# EasyEDA schematic LcsNodes-Diagnostic-Board-B.02.00.json
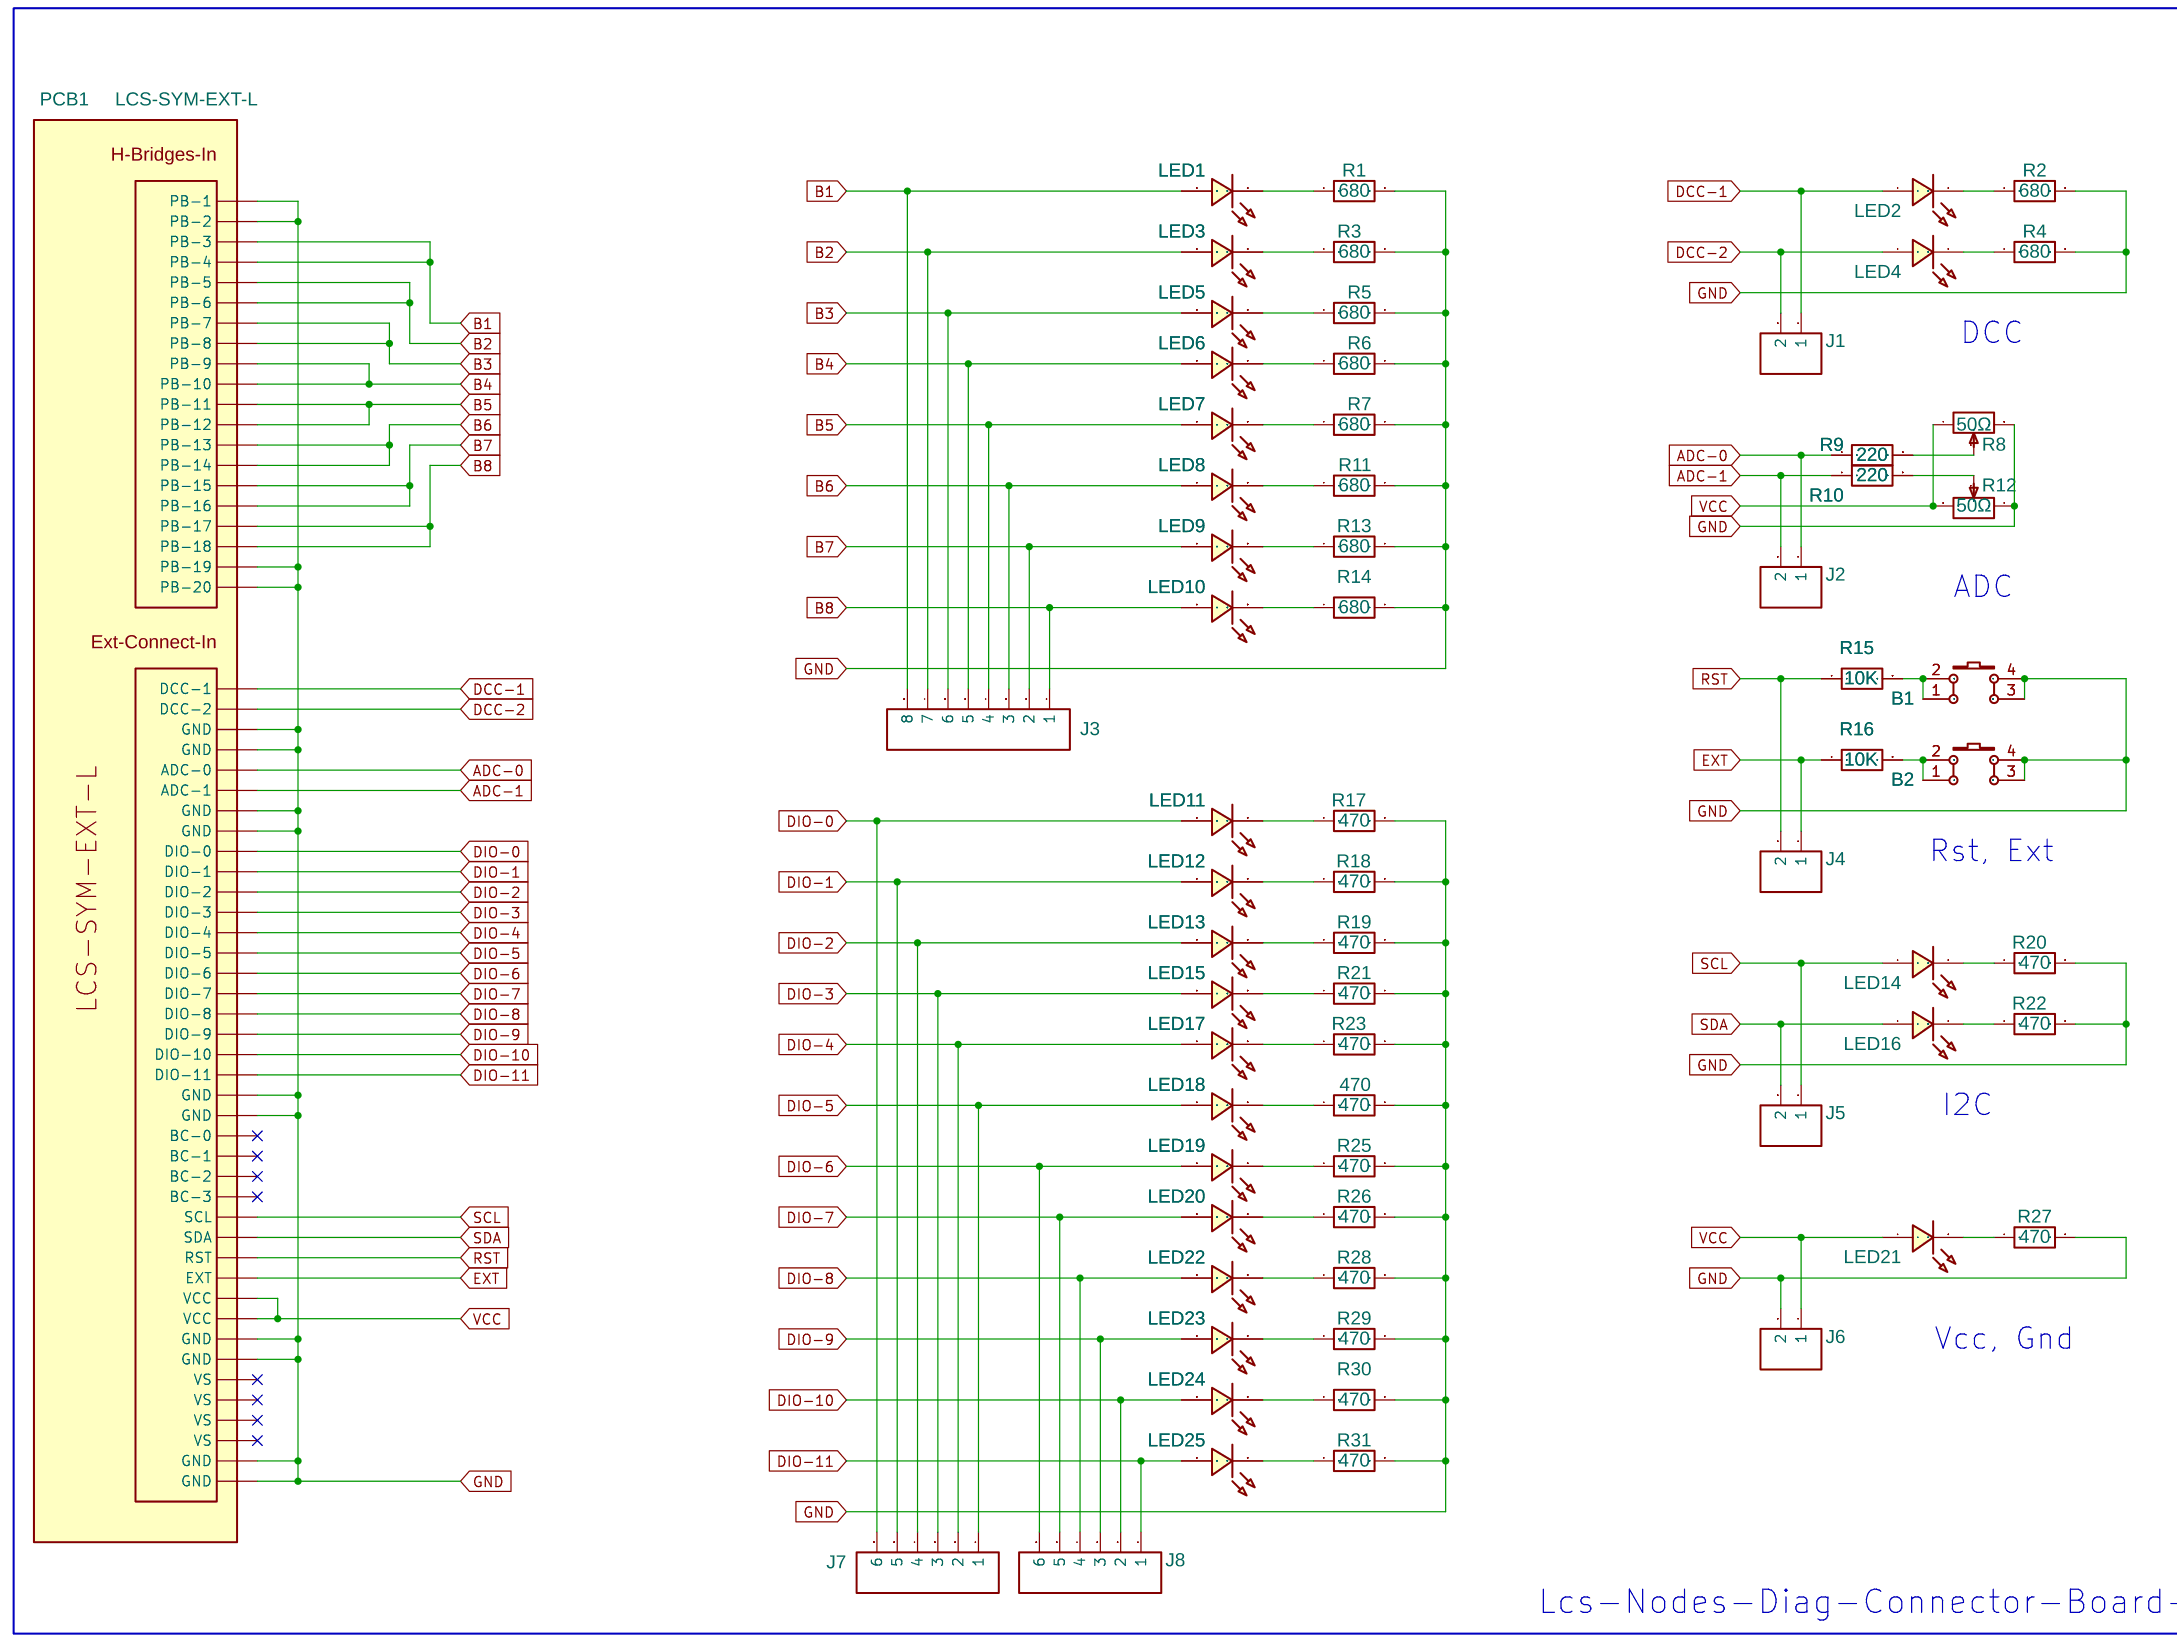
[diagram p0: schematic sheet]

## Parts
470  470  [R1206]
B1  Opt  [SW-SMD_4P-L6.0-W6.0-P4.50-LS9.0_C23873]
B2  Opt  [SW-SMD_4P-L6.0-W6.0-P4.50-LS9.0_C23873]
J1  HDR-M-2.54_1x2  [HDR-M-2.54_1X2]
J2  HDR-M-2.54_1x2  [HDR-M-2.54_1X2]
J3  HDR-M-2.54_1x8  [HDR-M-2.54_1X8]
J4  HDR-M-2.54_1x2  [HDR-M-2.54_1X2]
J5  HDR-M-2.54_1x2  [HDR-M-2.54_1X2]
J6  HDR-M-2.54_1x2  [HDR-M-2.54_1X2]
J7  HDR-M-2.54_1x6  [HDR-M-2.54_1X6]
J8  HDR-M-2.54_1x6  [HDR-M-2.54_1X6]
LED1  LED-0805_G  [LED-1206]
LED2  LED-0805_G  [LED-1206]
LED3  LED-0805_G  [LED-1206]
LED4  LED-0805_G  [LED-1206]
LED5  LED-0805_G  [LED-1206]
LED6  LED-0805_G  [LED-1206]
LED7  LED-0805_G  [LED-1206]
LED8  LED-0805_G  [LED-1206]
LED9  LED-0805_G  [LED-1206]
LED10  LED-0805_G  [LED-1206]
LED11  LED-0805_G  [LED-1206]
LED12  LED-0805_G  [LED-1206]
LED13  LED-0805_G  [LED-1206]
LED14  LED-0805_G  [LED-1206]
LED15  LED-0805_G  [LED-1206]
LED16  LED-0805_G  [LED-1206]
LED17  LED-0805_G  [LED-1206]
LED18  LED-0805_G  [LED-1206]
LED19  LED-0805_G  [LED-1206]
LED20  LED-0805_G  [LED-1206]
LED21  LED-0805_G  [LED-1206]
LED22  LED-0805_G  [LED-1206]
LED23  LED-0805_G  [LED-1206]
LED24  LED-0805_G  [LED-1206]
LED25  LED-0805_G  [LED-1206]
PCB1  LCS-SYM-EXT-L  [LCS-FP-EXT-L-10X4]
R1  680  [R1206]
R2  680  [R1206]
R3  680  [R1206]
R4  680  [R1206]
R5  680  [R1206]
R6  680  [R1206]
R7  680  [R1206]
R8  50Ω  [RES-ADJ-TH_3296W]
R9  220  [R1206]
R10  220  [R1206]
R11  680  [R1206]
R12  50Ω  [RES-ADJ-TH_3296W]
R13  680  [R1206]
R14  680  [R1206]
R15  10K  [R1206]
R16  10K  [R1206]
R17  470  [R1206]
R18  470  [R1206]
R19  470  [R1206]
R20  470  [R1206]
R21  470  [R1206]
R22  470  [R1206]
R23  470  [R1206]
R25  470  [R1206]
R26  470  [R1206]
R27  470  [R1206]
R28  470  [R1206]
R29  470  [R1206]
R30  470  [R1206]
R31  470  [R1206]

## Library data of the parts
470 R1-R7 R9-R11 R13-R23 R25-R31 = R_0805_EU: Contributor: LCEDA_Lib
B1 B2 = K4-6×6_TH: Supplier: LCSC; Supplier Part: C136684; Manufacturer: 韩国韩荣; Manufacturer Part: K2-1102DP-E4SW-04; Contributor: LCEDA_Lib; Package Display: No
J1 J2 J4-J6 = HDR-M-2.54_1x2: Supplier Part: C124375; Supplier: LCSC; Contributor: LCEDA_Lib
J3 = HDR-M-2.54_1x8: Supplier Part: C190820; Supplier: LCSC; Contributor: LCEDA_Lib
J7 J8 = HDR-M-2.54_1x6: Supplier Part: C190819; Supplier: LCSC; Contributor: LCEDA_Lib
LED1-LED25 = LED-0805_G: Manufacturer: 国星光电; Manufacturer Part: NCD0805G1; Supplier Part: C84260; Contributor: LCEDA_Lib
PCB1 = LCS-SYM-EXT-L: Contributor: helmut-f; Package Display: No
R8 R12 = Precision potentiometer 3296W/50ohm: Supplier Part: C21881; Supplier: LCSC; Manufacturer: ReliaPro; JLCPCB Part Class: Extended Part

## Nets
GND: 470.2 B1.3 B1.4 B2.3 B2.4 J6.2 PCB1.30(PB-1) PCB1.31(PB-2) PCB1.48(PB-19) PCB1.49(PB-20) PCB1.62(GND) PCB1.63(GND) PCB1.66(GND) PCB1.67(GND) PCB1.80(GND) PCB1.81(GND) PCB1.92(GND) PCB1.93(GND) PCB1.98(GND) PCB1.99(GND) R1.2 R2.2 R3.2 R4.2 R5.2 R6.2 R7.2 R8.3 R11.2 R12.1 R13.2 R14.2 R17.2 R18.2 R19.2 R20.2 R21.2 R22.2 R23.2 R25.2 R26.2 R27.2 R28.2 R29.2 R30.2 R31.2
VCC: J6.1 LED21.1 PCB1.90(VCC) PCB1.91(VCC) R8.1 R12.3
ADC-0: J2.1 PCB1.64(ADC-0) R9.1
ADC-1: J2.2 PCB1.65(ADC-1) R10.1
B1: J3.8 LED1.1 PCB1.32(PB-3) PCB1.33(PB-4)
B2: J3.7 LED3.1 PCB1.34(PB-5) PCB1.35(PB-6)
B3: J3.6 LED5.1 PCB1.36(PB-7) PCB1.37(PB-8)
B4: J3.5 LED6.1 PCB1.38(PB-9) PCB1.39(PB-10)
B5: J3.4 LED7.1 PCB1.40(PB-11) PCB1.41(PB-12)
B6: J3.3 LED8.1 PCB1.42(PB-13) PCB1.43(PB-14)
B7: J3.2 LED9.1 PCB1.44(PB-15) PCB1.45(PB-16)
B8: J3.1 LED10.1 PCB1.46(PB-17) PCB1.47(PB-18)
DCC-1: J1.1 LED2.1 PCB1.60(DCC-1)
DCC-2: J1.2 LED4.1 PCB1.61(DCC-2)
DIO-0: J7.6 LED11.1 PCB1.68(DIO-0)
DIO-1: J7.5 LED12.1 PCB1.69(DIO-1)
DIO-2: J7.4 LED13.1 PCB1.70(DIO-2)
DIO-3: J7.3 LED15.1 PCB1.71(DIO-3)
DIO-4: J7.2 LED17.1 PCB1.72(DIO-4)
DIO-5: J7.1 LED18.1 PCB1.73(DIO-5)
DIO-6: J8.6 LED19.1 PCB1.74(DIO-6)
DIO-7: J8.5 LED20.1 PCB1.75(DIO-7)
DIO-8: J8.4 LED22.1 PCB1.76(DIO-8)
DIO-9: J8.3 LED23.1 PCB1.77(DIO-9)
DIO-10: J8.2 LED24.1 PCB1.78(DIO-10)
DIO-11: J8.1 LED25.1 PCB1.79(DIO-11)
EXT: J4.1 PCB1.89(EXT) R16.1
RST: J4.2 PCB1.88(RST) R15.1
SCL: J5.1 LED14.1 PCB1.86(SCL)
SDA: J5.2 LED16.1 PCB1.87(SDA)
Net-(470-1): 470.1 LED18.2
Net-(B1-1): B1.1 B1.2 R15.2
Net-(B2-1): B2.1 B2.2 R16.2
Net-(LED1-2): LED1.2 R1.1
Net-(LED2-2): LED2.2 R2.1
Net-(LED3-2): LED3.2 R3.1
Net-(LED4-2): LED4.2 R4.1
Net-(LED5-2): LED5.2 R5.1
Net-(LED6-2): LED6.2 R6.1
Net-(LED7-2): LED7.2 R7.1
Net-(LED8-2): LED8.2 R11.1
Net-(LED9-2): LED9.2 R13.1
Net-(LED10-2): LED10.2 R14.1
Net-(LED11-2): LED11.2 R17.1
Net-(LED12-2): LED12.2 R18.1
Net-(LED13-2): LED13.2 R19.1
Net-(LED14-2): LED14.2 R20.1
Net-(LED15-2): LED15.2 R21.1
Net-(LED16-2): LED16.2 R22.1
Net-(LED17-2): LED17.2 R23.1
Net-(LED19-2): LED19.2 R25.1
Net-(LED20-2): LED20.2 R26.1
Net-(LED21-2): LED21.2 R27.1
Net-(LED22-2): LED22.2 R28.1
Net-(LED23-2): LED23.2 R29.1
Net-(LED24-2): LED24.2 R30.1
Net-(LED25-2): LED25.2 R31.1
Net-(R8-2): R8.2 R9.2
Net-(R10-2): R10.2 R12.2

Not connected (* = marked no-connect by the designer): PCB1 82(BC-0)* 83(BC-1)* 84(BC-2)* 85(BC-3)* 94(VS)* 95(VS)* 96(VS)* 97(VS)*

## Notes on the sheet
- DCC
- ADC
- Rst, Ext
- I2C
- Vcc, Gnd
- Lcs-Nodes-Diag-Connector-Board-B.02.00
